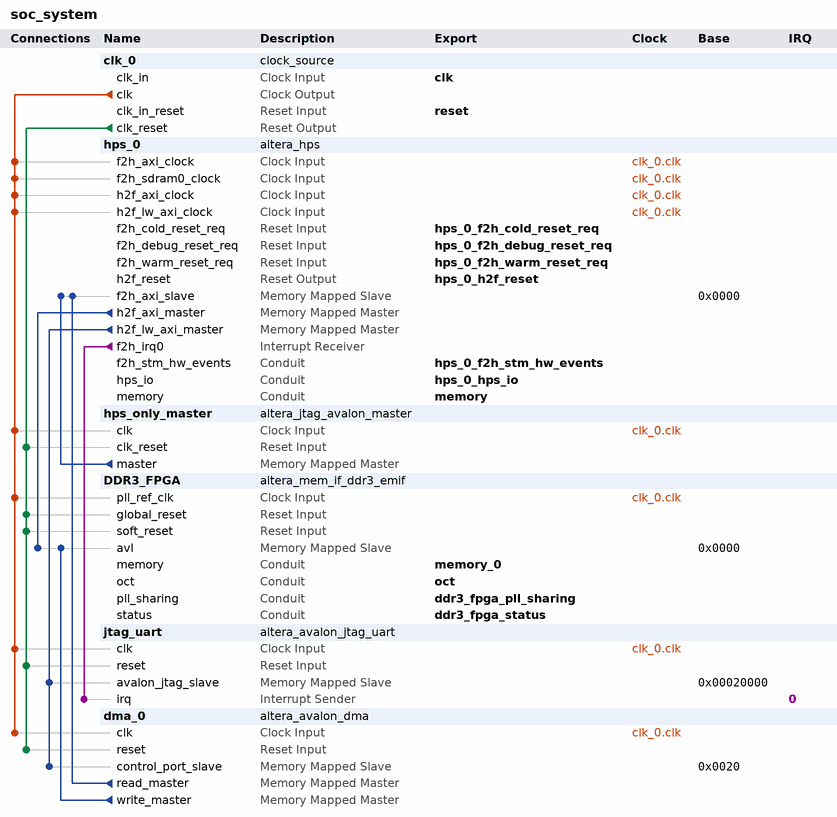
[diagram p0: system contents]
# Platform Designer (Qsys) system soc_system, Cyclone V 5CSXFC6D6F31C8ES
# Parameters at their usual value, and those the tool derives, are not listed.
package require -exact qsys 16.0
create_system soc_system
set_project_property DEVICE_FAMILY {Cyclone V}
set_project_property DEVICE 5CSXFC6D6F31C8ES

add_instance clk_0 clock_source 16.0
set_instance_parameter_value clk_0 clockFrequency 50000000

add_instance hps_0 altera_hps 16.0
set_instance_parameter_value hps_0 EMAC1_Mode RGMII
set_instance_parameter_value hps_0 EMAC1_PinMuxing {HPS I/O Set 0}
set_instance_parameter_value hps_0 F2SCLK_COLDRST_Enable true
set_instance_parameter_value hps_0 F2SCLK_DBGRST_Enable true
set_instance_parameter_value hps_0 F2SCLK_WARMRST_Enable true
set_instance_parameter_value hps_0 F2SDRAM_Type AXI-3
set_instance_parameter_value hps_0 F2SDRAM_Width 64
set_instance_parameter_value hps_0 F2SINTERRUPT_Enable true
set_instance_parameter_value hps_0 F2S_Width 2
set_instance_parameter_value hps_0 FPGA_PERIPHERAL_OUTPUT_CLOCK_FREQ_EMAC0_GTX_CLK 100
set_instance_parameter_value hps_0 FPGA_PERIPHERAL_OUTPUT_CLOCK_FREQ_EMAC0_MD_CLK 100.0
set_instance_parameter_value hps_0 FPGA_PERIPHERAL_OUTPUT_CLOCK_FREQ_EMAC1_GTX_CLK 100
set_instance_parameter_value hps_0 FPGA_PERIPHERAL_OUTPUT_CLOCK_FREQ_EMAC1_MD_CLK 100.0
set_instance_parameter_value hps_0 HPS_PROTOCOL DDR3
set_instance_parameter_value hps_0 I2C0_Mode N/A
set_instance_parameter_value hps_0 I2C0_PinMuxing Unused
set_instance_parameter_value hps_0 I2C1_Mode I2C
set_instance_parameter_value hps_0 I2C1_PinMuxing {HPS I/O Set 0}
set_instance_parameter_value hps_0 LWH2F_Enable true
set_instance_parameter_value hps_0 MEM_BANKADDR_WIDTH 3
set_instance_parameter_value hps_0 MEM_CLK_FREQ 400.0
set_instance_parameter_value hps_0 MEM_COL_ADDR_WIDTH 10
set_instance_parameter_value hps_0 MEM_DQ_WIDTH 32
set_instance_parameter_value hps_0 MEM_DRV_STR RZQ/7
set_instance_parameter_value hps_0 MEM_ROW_ADDR_WIDTH 15
set_instance_parameter_value hps_0 MEM_RTT_NOM RZQ/4
set_instance_parameter_value hps_0 MEM_RTT_WR RZQ/4
set_instance_parameter_value hps_0 MEM_TCL 11
set_instance_parameter_value hps_0 MEM_TFAW_NS 30.0
set_instance_parameter_value hps_0 MEM_TRAS_NS 35.0
set_instance_parameter_value hps_0 MEM_TRCD_NS 13.75
set_instance_parameter_value hps_0 MEM_TRFC_NS 260.0
set_instance_parameter_value hps_0 MEM_TRP_NS 13.75
set_instance_parameter_value hps_0 MEM_VENDOR JEDEC
set_instance_parameter_value hps_0 MEM_WTCL 8
set_instance_parameter_value hps_0 QSPI_Mode {1 SS}
set_instance_parameter_value hps_0 QSPI_PinMuxing {HPS I/O Set 0}
set_instance_parameter_value hps_0 REF_CLK_FREQ 25.0
set_instance_parameter_value hps_0 S2FCLK_USER2CLK 5
set_instance_parameter_value hps_0 S2F_Width 2
set_instance_parameter_value hps_0 SDIO_Mode {4-bit Data}
set_instance_parameter_value hps_0 SDIO_PinMuxing {HPS I/O Set 0}
set_instance_parameter_value hps_0 SPIM0_Mode {Single Slave Select}
set_instance_parameter_value hps_0 SPIM0_PinMuxing {HPS I/O Set 0}
set_instance_parameter_value hps_0 SPIM1_Mode {Single Slave Select}
set_instance_parameter_value hps_0 SPIM1_PinMuxing {HPS I/O Set 0}
set_instance_parameter_value hps_0 STM_Enable true
set_instance_parameter_value hps_0 TIMING_BOARD_AC_SKEW 0.03
set_instance_parameter_value hps_0 TIMING_BOARD_AC_TO_CK_SKEW 0.0
set_instance_parameter_value hps_0 TIMING_BOARD_DQ_TO_DQS_SKEW 0.0
set_instance_parameter_value hps_0 TIMING_BOARD_MAX_CK_DELAY 0.03
set_instance_parameter_value hps_0 TIMING_BOARD_MAX_DQS_DELAY 0.02
set_instance_parameter_value hps_0 TIMING_BOARD_SKEW_BETWEEN_DQS 0.08
set_instance_parameter_value hps_0 TIMING_BOARD_SKEW_CKDQS_DIMM_MAX 0.16
set_instance_parameter_value hps_0 TIMING_BOARD_SKEW_CKDQS_DIMM_MIN 0.09
set_instance_parameter_value hps_0 TIMING_BOARD_SKEW_WITHIN_DQS 0.01
set_instance_parameter_value hps_0 TIMING_TDH 65
set_instance_parameter_value hps_0 TIMING_TDQSCK 255
set_instance_parameter_value hps_0 TIMING_TDQSQ 125
set_instance_parameter_value hps_0 TIMING_TDS 30
set_instance_parameter_value hps_0 TIMING_TIH 140
set_instance_parameter_value hps_0 TIMING_TIS 180
set_instance_parameter_value hps_0 TIMING_TQSH 0.4
set_instance_parameter_value hps_0 UART0_Mode {No Flow Control}
set_instance_parameter_value hps_0 UART0_PinMuxing {HPS I/O Set 0}
set_instance_parameter_value hps_0 USB1_Mode SDR
set_instance_parameter_value hps_0 USB1_PinMuxing {HPS I/O Set 0}
set_instance_parameter_value hps_0 desired_cfg_clk_mhz 100.0
set_instance_parameter_value hps_0 desired_qspi_clk_mhz 400.0

add_instance hps_only_master altera_jtag_avalon_master 16.0

add_instance DDR3_FPGA altera_mem_if_ddr3_emif 16.0
set_instance_parameter_value DDR3_FPGA AVL_MAX_SIZE 32
set_instance_parameter_value DDR3_FPGA CALIBRATION_MODE Full
set_instance_parameter_value DDR3_FPGA CPORT_TYPE_PORT Bidirectional,Bidirectional,Bidirectional,Bidirectional,Bidirectional,Bidirectional
set_instance_parameter_value DDR3_FPGA EXPORT_AFI_HALF_CLK false
set_instance_parameter_value DDR3_FPGA HARD_EMIF false
set_instance_parameter_value DDR3_FPGA MEM_BANKADDR_WIDTH 3
set_instance_parameter_value DDR3_FPGA MEM_CLK_FREQ 300.0
set_instance_parameter_value DDR3_FPGA MEM_CLK_FREQ_MAX 400.0
set_instance_parameter_value DDR3_FPGA MEM_COL_ADDR_WIDTH 10
set_instance_parameter_value DDR3_FPGA MEM_DQ_WIDTH 32
set_instance_parameter_value DDR3_FPGA MEM_FORMAT DISCRETE
set_instance_parameter_value DDR3_FPGA MEM_ROW_ADDR_WIDTH 13
set_instance_parameter_value DDR3_FPGA MEM_TCL 6
set_instance_parameter_value DDR3_FPGA MEM_TFAW_NS 50.0
set_instance_parameter_value DDR3_FPGA MEM_TRAS_NS 37.5
set_instance_parameter_value DDR3_FPGA MEM_TRCD_NS 15.0
set_instance_parameter_value DDR3_FPGA MEM_TRFC_NS 300.0
set_instance_parameter_value DDR3_FPGA MEM_TRP_NS 15.0
set_instance_parameter_value DDR3_FPGA MEM_TRRD_NS 13.2
set_instance_parameter_value DDR3_FPGA MEM_TRTP_NS 13.2
set_instance_parameter_value DDR3_FPGA MEM_TWTR 4
set_instance_parameter_value DDR3_FPGA MEM_VENDOR JEDEC
set_instance_parameter_value DDR3_FPGA MEM_WTCL 5
set_instance_parameter_value DDR3_FPGA PLL_LOCATION Top_Bottom
set_instance_parameter_value DDR3_FPGA POWER_OF_TWO_BUS false
set_instance_parameter_value DDR3_FPGA PRIORITY_PORT 1,1,1,1,1,1
set_instance_parameter_value DDR3_FPGA RATE Half
set_instance_parameter_value DDR3_FPGA REF_CLK_FREQ 50.0
set_instance_parameter_value DDR3_FPGA SPEED_GRADE 8
set_instance_parameter_value DDR3_FPGA TIMING_BOARD_AC_SKEW 0.03
set_instance_parameter_value DDR3_FPGA TIMING_BOARD_AC_TO_CK_SKEW 0.0
set_instance_parameter_value DDR3_FPGA TIMING_BOARD_DQ_TO_DQS_SKEW 0.0
set_instance_parameter_value DDR3_FPGA TIMING_BOARD_MAX_CK_DELAY 0.03
set_instance_parameter_value DDR3_FPGA TIMING_BOARD_MAX_DQS_DELAY 0.03
set_instance_parameter_value DDR3_FPGA TIMING_BOARD_SKEW_BETWEEN_DQS 0.08
set_instance_parameter_value DDR3_FPGA TIMING_BOARD_SKEW_CKDQS_DIMM_MAX 0.0
set_instance_parameter_value DDR3_FPGA TIMING_BOARD_SKEW_CKDQS_DIMM_MIN 0.0
set_instance_parameter_value DDR3_FPGA TIMING_BOARD_SKEW_WITHIN_DQS 0.01
set_instance_parameter_value DDR3_FPGA TIMING_TDH 150
set_instance_parameter_value DDR3_FPGA TIMING_TDQSCK 400
set_instance_parameter_value DDR3_FPGA TIMING_TDQSQ 200
set_instance_parameter_value DDR3_FPGA TIMING_TDQSS 0.25
set_instance_parameter_value DDR3_FPGA TIMING_TDS 75
set_instance_parameter_value DDR3_FPGA TIMING_TDSH 0.2
set_instance_parameter_value DDR3_FPGA TIMING_TDSS 0.2
set_instance_parameter_value DDR3_FPGA TIMING_TIH 275
set_instance_parameter_value DDR3_FPGA TIMING_TIS 200
set_instance_parameter_value DDR3_FPGA TIMING_TQSH 0.38
set_instance_parameter_value DDR3_FPGA USER_DEBUG_LEVEL 1

add_instance jtag_uart altera_avalon_jtag_uart 16.0
set_instance_parameter_value jtag_uart allowMultipleConnections true
set_instance_parameter_value jtag_uart simInteractiveOptions INTERACTIVE_ASCII_OUTPUT

add_instance dma_0 altera_avalon_dma 16.0
set_instance_parameter_value dma_0 allowByteTransactions true
set_instance_parameter_value dma_0 allowDoubleWordTransactions true
set_instance_parameter_value dma_0 allowHalfWordTransactions true
set_instance_parameter_value dma_0 allowQuadWordTransactions true
set_instance_parameter_value dma_0 burstEnable false
set_instance_parameter_value dma_0 fifoDepth 32
set_instance_parameter_value dma_0 maxBurstSize 128
set_instance_parameter_value dma_0 minimumDmaTransactionRegisterWidth 32

# connections
add_connection clk_0.clk DDR3_FPGA.pll_ref_clk clock
add_connection clk_0.clk dma_0.clk clock
add_connection clk_0.clk hps_0.f2h_axi_clock clock
add_connection clk_0.clk hps_0.f2h_sdram0_clock clock
add_connection clk_0.clk hps_0.h2f_axi_clock clock
add_connection clk_0.clk hps_0.h2f_lw_axi_clock clock
add_connection clk_0.clk hps_only_master.clk clock
add_connection clk_0.clk jtag_uart.clk clock
add_connection clk_0.clk_reset DDR3_FPGA.global_reset reset
add_connection clk_0.clk_reset DDR3_FPGA.soft_reset reset
add_connection clk_0.clk_reset dma_0.reset reset
add_connection clk_0.clk_reset hps_only_master.clk_reset reset
add_connection clk_0.clk_reset jtag_uart.reset reset
add_connection dma_0.read_master hps_0.f2h_axi_slave avalon
set_connection_parameter_value dma_0.read_master/hps_0.f2h_axi_slave baseAddress 0x0000
add_connection dma_0.write_master DDR3_FPGA.avl avalon
set_connection_parameter_value dma_0.write_master/DDR3_FPGA.avl baseAddress 0x0000
add_connection hps_0.h2f_axi_master DDR3_FPGA.avl avalon
set_connection_parameter_value hps_0.h2f_axi_master/DDR3_FPGA.avl baseAddress 0x0000
add_connection hps_0.h2f_lw_axi_master dma_0.control_port_slave avalon
set_connection_parameter_value hps_0.h2f_lw_axi_master/dma_0.control_port_slave baseAddress 0x0020
add_connection hps_0.h2f_lw_axi_master jtag_uart.avalon_jtag_slave avalon
set_connection_parameter_value hps_0.h2f_lw_axi_master/jtag_uart.avalon_jtag_slave baseAddress 0x00020000
add_connection hps_only_master.master hps_0.f2h_axi_slave avalon
set_connection_parameter_value hps_only_master.master/hps_0.f2h_axi_slave baseAddress 0x0000
add_connection hps_0.f2h_irq0 jtag_uart.irq interrupt
set_connection_parameter_value hps_0.f2h_irq0/jtag_uart.irq irqNumber 0

# exported interfaces
add_interface clk clock sink
set_interface_property clk EXPORT_OF clk_0.clk_in
add_interface ddr3_fpga_pll_sharing conduit end
set_interface_property ddr3_fpga_pll_sharing EXPORT_OF DDR3_FPGA.pll_sharing
add_interface ddr3_fpga_status conduit end
set_interface_property ddr3_fpga_status EXPORT_OF DDR3_FPGA.status
add_interface hps_0_f2h_cold_reset_req reset sink
set_interface_property hps_0_f2h_cold_reset_req EXPORT_OF hps_0.f2h_cold_reset_req
add_interface hps_0_f2h_debug_reset_req reset sink
set_interface_property hps_0_f2h_debug_reset_req EXPORT_OF hps_0.f2h_debug_reset_req
add_interface hps_0_f2h_stm_hw_events conduit end
set_interface_property hps_0_f2h_stm_hw_events EXPORT_OF hps_0.f2h_stm_hw_events
add_interface hps_0_f2h_warm_reset_req reset sink
set_interface_property hps_0_f2h_warm_reset_req EXPORT_OF hps_0.f2h_warm_reset_req
add_interface hps_0_h2f_reset reset source
set_interface_property hps_0_h2f_reset EXPORT_OF hps_0.h2f_reset
add_interface hps_0_hps_io conduit end
set_interface_property hps_0_hps_io EXPORT_OF hps_0.hps_io
add_interface memory conduit end
set_interface_property memory EXPORT_OF hps_0.memory
add_interface memory_0 conduit end
set_interface_property memory_0 EXPORT_OF DDR3_FPGA.memory
add_interface oct conduit end
set_interface_property oct EXPORT_OF DDR3_FPGA.oct
add_interface reset reset sink
set_interface_property reset EXPORT_OF clk_0.clk_in_reset

set_interconnect_requirement {$system} qsys_mm.clockCrossingAdapter HANDSHAKE
set_interconnect_requirement {$system} qsys_mm.maxAdditionalLatency 1

save_system soc_system.qsys
